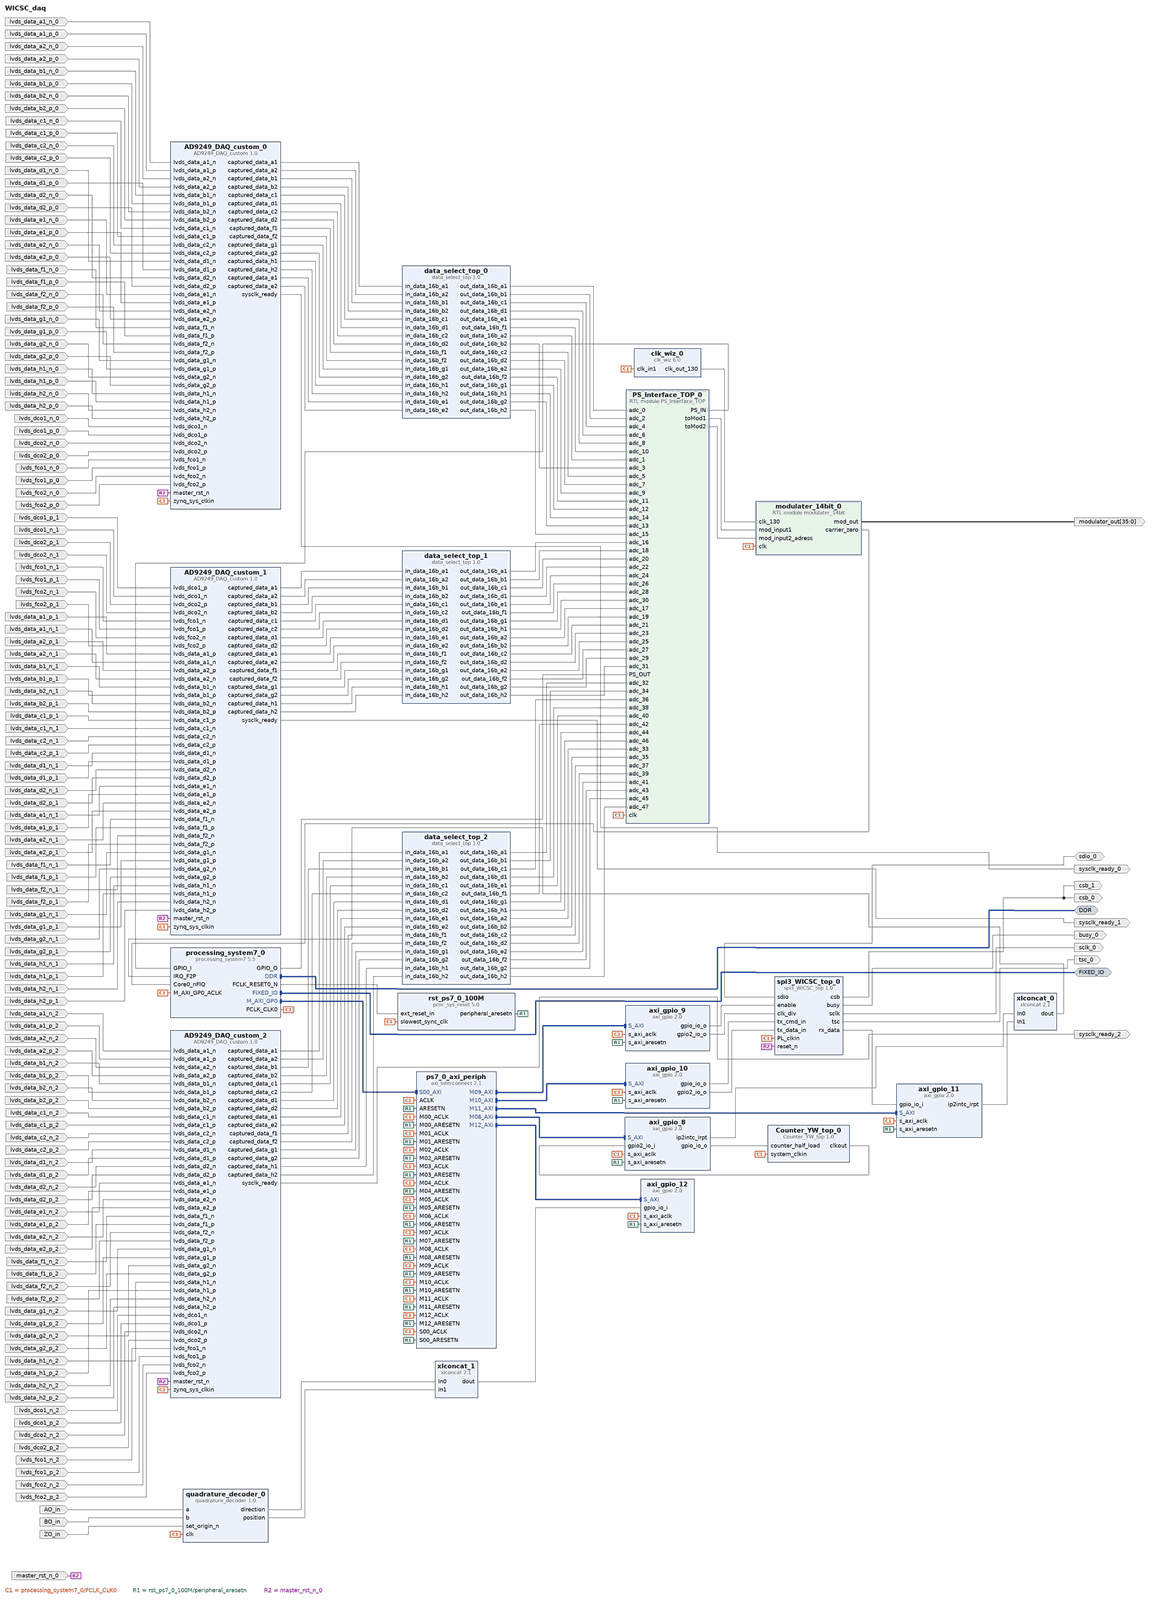
[diagram p0: block diagram of the top level, whole]
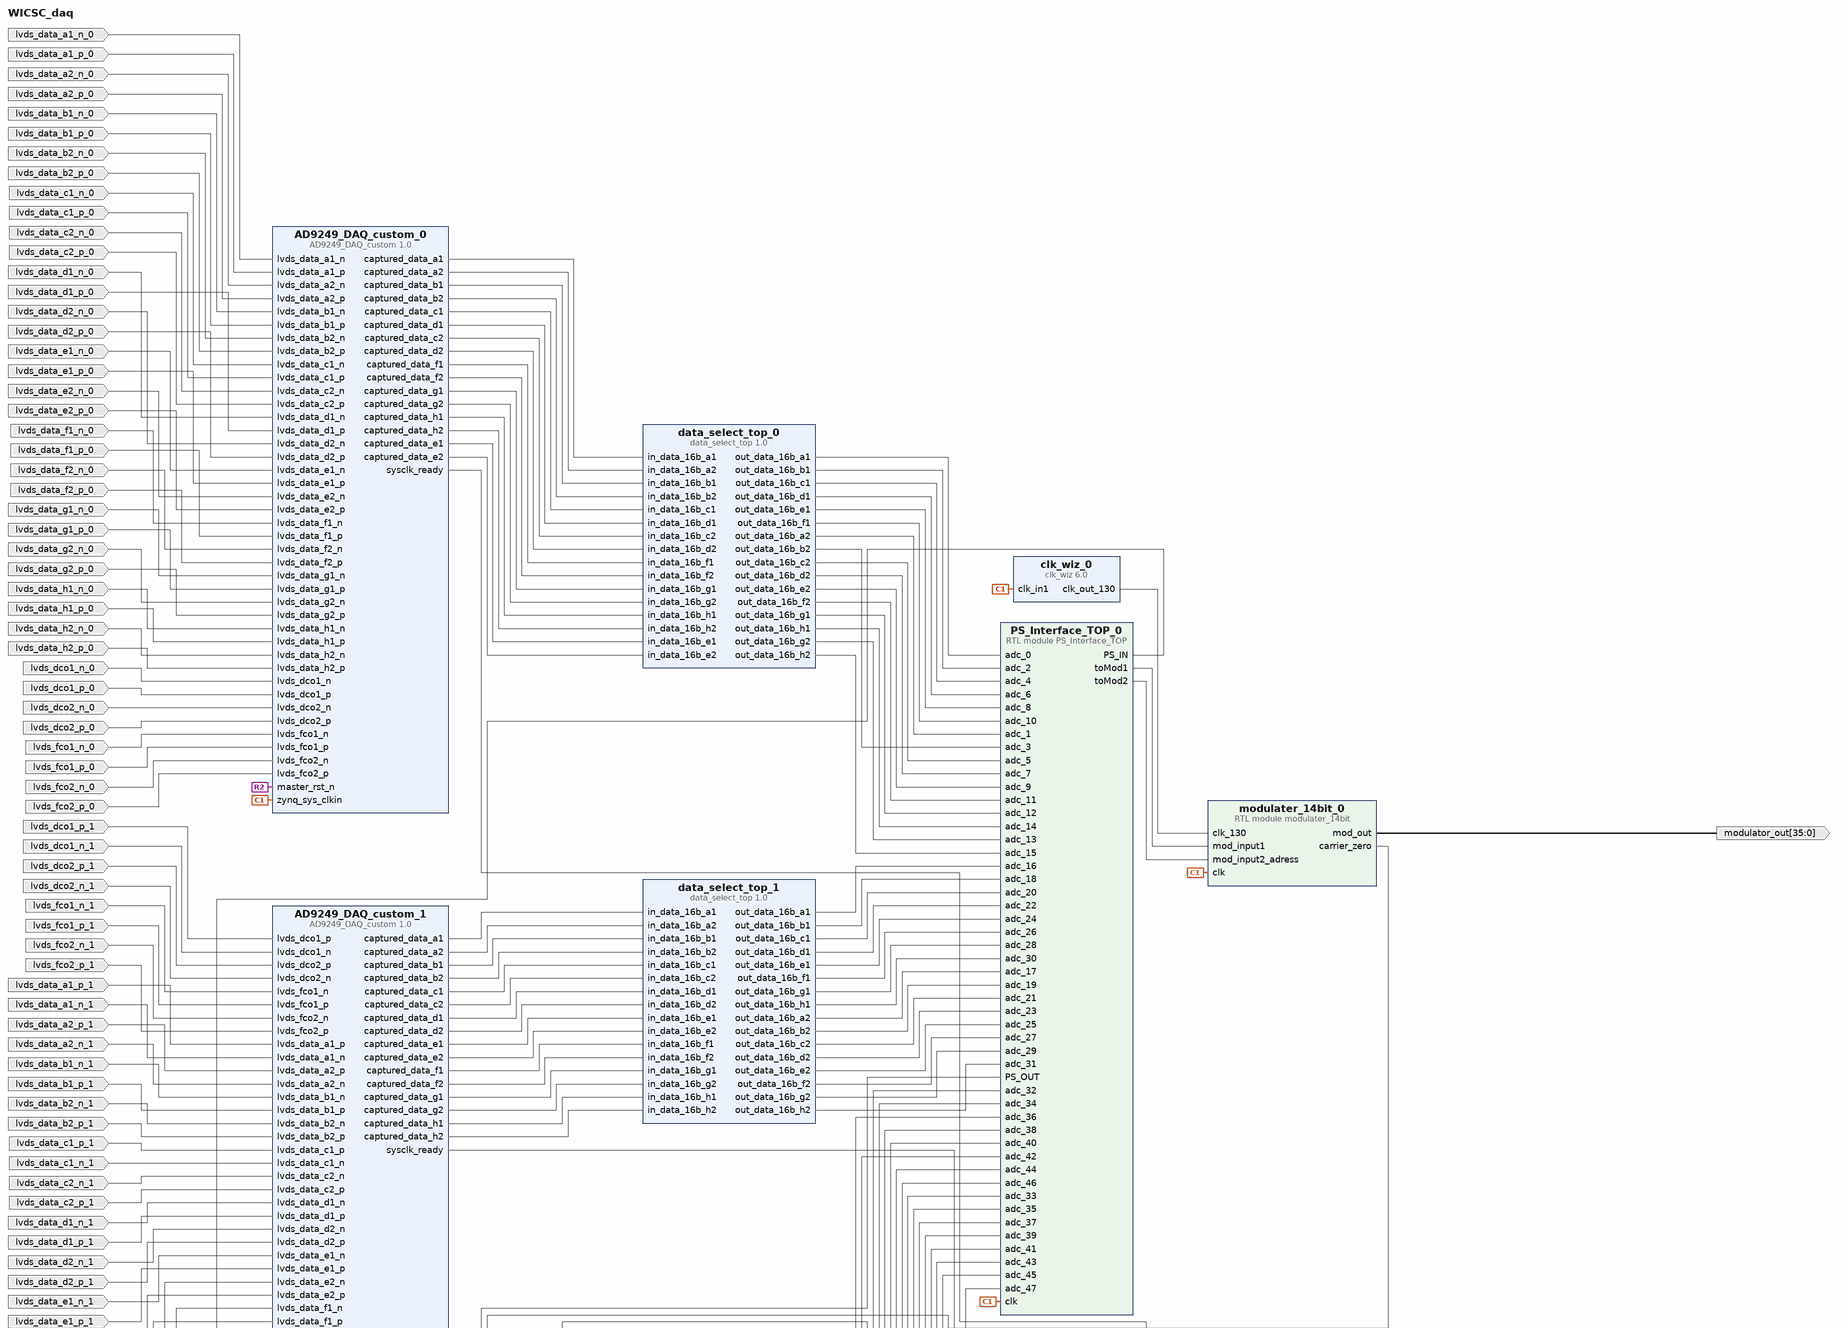
[diagram p1: block diagram of the top level, upper part]
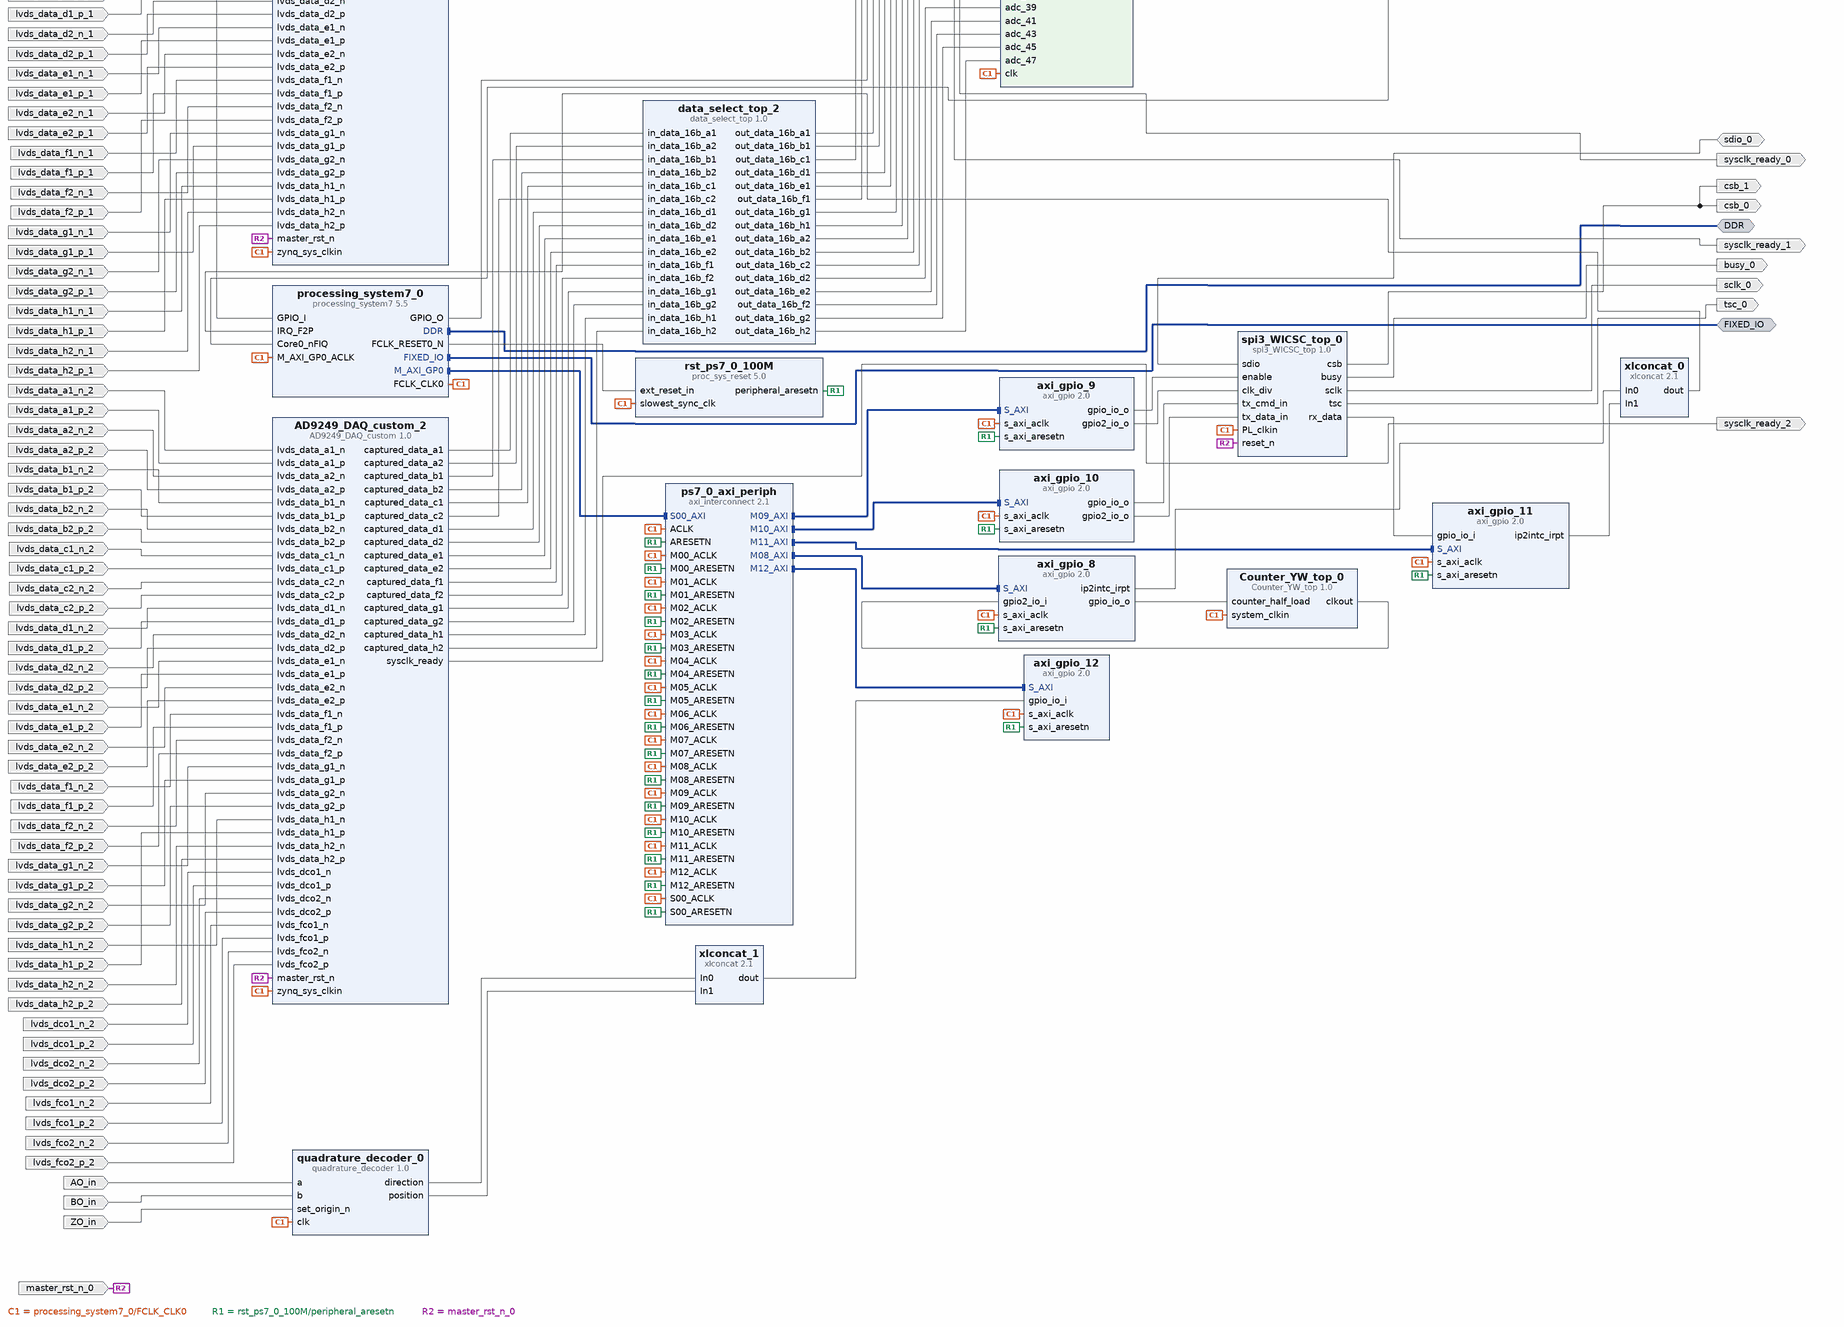
[diagram p2: block diagram of the top level, lower part]
# Vivado block design WICSC_daq, xc7z020clg484-1, Vivado 2020.1
create_bd_design WICSC_daq

create_bd_intf_port -mode Master -vlnv xilinx.com:interface:ddrx_rtl:1.0 DDR
create_bd_intf_port -mode Master -vlnv xilinx.com:display_processing_system7:fixedio_rtl:1.0 FIXED_IO
create_bd_port -dir I lvds_data_a1_n_0
create_bd_port -dir I lvds_data_a1_p_0
create_bd_port -dir I lvds_data_a2_n_0
create_bd_port -dir I lvds_data_a2_p_0
create_bd_port -dir I lvds_data_b1_n_0
create_bd_port -dir I lvds_data_b1_p_0
create_bd_port -dir I lvds_data_b2_n_0
create_bd_port -dir I lvds_data_b2_p_0
create_bd_port -dir I lvds_data_c1_n_0
create_bd_port -dir I lvds_data_c1_p_0
create_bd_port -dir I lvds_data_c2_n_0
create_bd_port -dir I lvds_data_c2_p_0
create_bd_port -dir I lvds_data_d1_n_0
create_bd_port -dir I lvds_data_d1_p_0
create_bd_port -dir I lvds_data_d2_n_0
create_bd_port -dir I lvds_data_d2_p_0
create_bd_port -dir I lvds_data_e1_n_0
create_bd_port -dir I lvds_data_e1_p_0
create_bd_port -dir I lvds_data_e2_n_0
create_bd_port -dir I lvds_data_e2_p_0
create_bd_port -dir I lvds_data_f1_n_0
create_bd_port -dir I lvds_data_f1_p_0
create_bd_port -dir I lvds_data_f2_n_0
create_bd_port -dir I lvds_data_f2_p_0
create_bd_port -dir I lvds_data_g1_n_0
create_bd_port -dir I lvds_data_g1_p_0
create_bd_port -dir I lvds_data_g2_n_0
create_bd_port -dir I lvds_data_g2_p_0
create_bd_port -dir I lvds_data_h1_n_0
create_bd_port -dir I lvds_data_h1_p_0
create_bd_port -dir I lvds_data_h2_n_0
create_bd_port -dir I lvds_data_h2_p_0
create_bd_port -dir I lvds_dco1_n_0
create_bd_port -dir I lvds_dco1_p_0
create_bd_port -dir I lvds_dco2_n_0
create_bd_port -dir I lvds_dco2_p_0
create_bd_port -dir I lvds_fco1_n_0
create_bd_port -dir I lvds_fco1_p_0
create_bd_port -dir I lvds_fco2_n_0
create_bd_port -dir I lvds_fco2_p_0
create_bd_port -dir I -type rst master_rst_n_0
create_bd_port -dir O sysclk_ready_0
create_bd_port -dir O busy_0
create_bd_port -dir O csb_0
create_bd_port -dir O sclk_0
create_bd_port -dir IO sdio_0
create_bd_port -dir O tsc_0
create_bd_port -dir O csb_1
create_bd_port -dir I AO_in
create_bd_port -dir I BO_in
create_bd_port -dir I ZO_in
create_bd_port -dir I lvds_data_a1_n_1
create_bd_port -dir I lvds_data_a1_p_1
create_bd_port -dir I lvds_data_a2_n_1
create_bd_port -dir I lvds_data_a2_p_1
create_bd_port -dir I lvds_data_b1_n_1
create_bd_port -dir I lvds_data_b1_p_1
create_bd_port -dir I lvds_data_b2_n_1
create_bd_port -dir I lvds_data_b2_p_1
create_bd_port -dir I lvds_data_c1_n_1
create_bd_port -dir I lvds_data_c1_p_1
create_bd_port -dir I lvds_data_c2_n_1
create_bd_port -dir I lvds_data_c2_p_1
create_bd_port -dir I lvds_data_d1_n_1
create_bd_port -dir I lvds_data_d1_p_1
create_bd_port -dir I lvds_data_d2_n_1
create_bd_port -dir I lvds_data_d2_p_1
create_bd_port -dir I lvds_data_e1_n_1
create_bd_port -dir I lvds_data_e1_p_1
create_bd_port -dir I lvds_data_e2_n_1
create_bd_port -dir I lvds_data_e2_p_1
create_bd_port -dir I lvds_data_f1_n_1
create_bd_port -dir I lvds_data_f1_p_1
create_bd_port -dir I lvds_data_f2_n_1
create_bd_port -dir I lvds_data_f2_p_1
create_bd_port -dir I lvds_data_g1_n_1
create_bd_port -dir I lvds_data_g1_p_1
create_bd_port -dir I lvds_data_g2_n_1
create_bd_port -dir I lvds_data_g2_p_1
create_bd_port -dir I lvds_data_h1_n_1
create_bd_port -dir I lvds_data_h1_p_1
create_bd_port -dir I lvds_data_h2_n_1
create_bd_port -dir I lvds_data_h2_p_1
create_bd_port -dir I lvds_dco1_n_1
create_bd_port -dir I lvds_dco1_p_1
create_bd_port -dir I lvds_dco2_n_1
create_bd_port -dir I lvds_dco2_p_1
create_bd_port -dir I lvds_fco1_n_1
create_bd_port -dir I lvds_fco1_p_1
create_bd_port -dir I lvds_fco2_n_1
create_bd_port -dir I lvds_fco2_p_1
create_bd_port -dir I lvds_data_a1_n_2
create_bd_port -dir I lvds_data_a1_p_2
create_bd_port -dir I lvds_data_a2_n_2
create_bd_port -dir I lvds_data_a2_p_2
create_bd_port -dir I lvds_data_b1_n_2
create_bd_port -dir I lvds_data_b1_p_2
create_bd_port -dir I lvds_data_b2_n_2
create_bd_port -dir I lvds_data_b2_p_2
create_bd_port -dir I lvds_data_c1_n_2
create_bd_port -dir I lvds_data_c1_p_2
create_bd_port -dir I lvds_data_c2_n_2
create_bd_port -dir I lvds_data_c2_p_2
create_bd_port -dir I lvds_data_d1_n_2
create_bd_port -dir I lvds_data_d1_p_2
create_bd_port -dir I lvds_data_d2_n_2
create_bd_port -dir I lvds_data_d2_p_2
create_bd_port -dir I lvds_data_e1_n_2
create_bd_port -dir I lvds_data_e1_p_2
create_bd_port -dir I lvds_data_e2_n_2
create_bd_port -dir I lvds_data_e2_p_2
create_bd_port -dir I lvds_data_f1_n_2
create_bd_port -dir I lvds_data_f1_p_2
create_bd_port -dir I lvds_data_f2_n_2
create_bd_port -dir I lvds_data_f2_p_2
create_bd_port -dir I lvds_data_g1_n_2
create_bd_port -dir I lvds_data_g1_p_2
create_bd_port -dir I lvds_data_g2_n_2
create_bd_port -dir I lvds_data_g2_p_2
create_bd_port -dir I lvds_data_h1_n_2
create_bd_port -dir I lvds_data_h1_p_2
create_bd_port -dir I lvds_data_h2_n_2
create_bd_port -dir I lvds_data_h2_p_2
create_bd_port -dir I lvds_dco1_n_2
create_bd_port -dir I lvds_dco1_p_2
create_bd_port -dir I lvds_dco2_n_2
create_bd_port -dir I lvds_dco2_p_2
create_bd_port -dir I lvds_fco1_n_2
create_bd_port -dir I lvds_fco1_p_2
create_bd_port -dir I lvds_fco2_n_2
create_bd_port -dir I lvds_fco2_p_2
create_bd_port -dir O -from 35 -to 0 -type data modulator_out
create_bd_port -dir O sysclk_ready_1
create_bd_port -dir O sysclk_ready_2

create_bd_cell -type ip -vlnv xilinx.com:ip:processing_system7:5.5 processing_system7_0
set_property -dict [list \
  CONFIG.PCW_APU_PERIPHERAL_FREQMHZ 666.666666 \
  CONFIG.PCW_CAN0_CAN0_IO {MIO 46 .. 47} \
  CONFIG.PCW_CAN0_PERIPHERAL_ENABLE 1 \
  CONFIG.PCW_CAN_PERIPHERAL_FREQMHZ 23.8095 \
  CONFIG.PCW_CORE0_FIQ_INTR 1 \
  CONFIG.PCW_ENET0_ENET0_IO {MIO 16 .. 27} \
  CONFIG.PCW_ENET0_GRP_MDIO_ENABLE 1 \
  CONFIG.PCW_ENET0_GRP_MDIO_IO {MIO 52 .. 53} \
  CONFIG.PCW_ENET0_PERIPHERAL_ENABLE 1 \
  CONFIG.PCW_ENET0_PERIPHERAL_FREQMHZ {100 Mbps} \
  CONFIG.PCW_ENET0_RESET_ENABLE 1 \
  CONFIG.PCW_ENET0_RESET_IO {MIO 11} \
  CONFIG.PCW_ENET_RESET_ENABLE 1 \
  CONFIG.PCW_ENET_RESET_SELECT {Share reset pin} \
  CONFIG.PCW_FPGA0_PERIPHERAL_FREQMHZ 100 \
  CONFIG.PCW_GPIO_EMIO_GPIO_ENABLE 1 \
  CONFIG.PCW_GPIO_EMIO_GPIO_IO 64 \
  CONFIG.PCW_GPIO_MIO_GPIO_ENABLE 1 \
  CONFIG.PCW_GPIO_MIO_GPIO_IO MIO \
  CONFIG.PCW_I2C0_GRP_INT_ENABLE 0 \
  CONFIG.PCW_I2C0_I2C0_IO {MIO 50 .. 51} \
  CONFIG.PCW_I2C0_PERIPHERAL_ENABLE 1 \
  CONFIG.PCW_I2C0_RESET_ENABLE 1 \
  CONFIG.PCW_I2C0_RESET_IO {MIO 13} \
  CONFIG.PCW_I2C_PERIPHERAL_FREQMHZ 111.111115 \
  CONFIG.PCW_I2C_RESET_ENABLE 1 \
  CONFIG.PCW_I2C_RESET_SELECT {Share reset pin} \
  CONFIG.PCW_IRQ_F2P_INTR 1 \
  CONFIG.PCW_PRESET_BANK0_VOLTAGE {LVCMOS 1.8V} \
  CONFIG.PCW_PRESET_BANK1_VOLTAGE {LVCMOS 1.8V} \
  CONFIG.PCW_QSPI_GRP_FBCLK_ENABLE 1 \
  CONFIG.PCW_QSPI_GRP_FBCLK_IO {MIO 8} \
  CONFIG.PCW_QSPI_GRP_SINGLE_SS_ENABLE 1 \
  CONFIG.PCW_QSPI_GRP_SINGLE_SS_IO {MIO 1 .. 6} \
  CONFIG.PCW_QSPI_PERIPHERAL_ENABLE 1 \
  CONFIG.PCW_QSPI_QSPI_IO {MIO 1 .. 6} \
  CONFIG.PCW_SD0_GRP_CD_ENABLE 1 \
  CONFIG.PCW_SD0_GRP_CD_IO {MIO 0} \
  CONFIG.PCW_SD0_GRP_WP_ENABLE 1 \
  CONFIG.PCW_SD0_GRP_WP_IO {MIO 15} \
  CONFIG.PCW_SD0_PERIPHERAL_ENABLE 1 \
  CONFIG.PCW_SD0_SD0_IO {MIO 40 .. 45} \
  CONFIG.PCW_SDIO_PERIPHERAL_FREQMHZ 50 \
  CONFIG.PCW_SINGLE_QSPI_DATA_MODE x4 \
  CONFIG.PCW_TTC0_PERIPHERAL_ENABLE 1 \
  CONFIG.PCW_TTC0_TTC0_IO EMIO \
  CONFIG.PCW_UART1_PERIPHERAL_ENABLE 1 \
  CONFIG.PCW_UART1_UART1_IO {MIO 48 .. 49} \
  CONFIG.PCW_UART_PERIPHERAL_FREQMHZ 50 \
  CONFIG.PCW_UIPARAM_DDR_FREQ_MHZ 533.333333 \
  CONFIG.PCW_UIPARAM_DDR_PARTNO {MT41J256M8 HX-15E} \
  CONFIG.PCW_USB0_PERIPHERAL_ENABLE 1 \
  CONFIG.PCW_USB0_RESET_ENABLE 1 \
  CONFIG.PCW_USB0_RESET_IO {MIO 7} \
  CONFIG.PCW_USB0_USB0_IO {MIO 28 .. 39} \
  CONFIG.PCW_USB_RESET_ENABLE 1 \
  CONFIG.PCW_USB_RESET_SELECT {Share reset pin} \
  CONFIG.PCW_USE_FABRIC_INTERRUPT 1 \
  CONFIG.preset ZC702 \
] [get_bd_cells processing_system7_0]
# 224 more settings of processing_system7_0 are not shown: defaults, MIO pin electricals, DDR timing, and values the tool derives
create_bd_cell -type ip -vlnv xilinx.com:ip:axi_interconnect:2.1 ps7_0_axi_periph
set_property -dict {CONFIG.NUM_MI 13} [get_bd_cells ps7_0_axi_periph]
create_bd_cell -type ip -vlnv xilinx.com:ip:proc_sys_reset:5.0 rst_ps7_0_100M
create_bd_cell -type ip -vlnv kth.se:user:Counter_YW_top:1.0 Counter_YW_top_0
create_bd_cell -type ip -vlnv xilinx.com:ip:axi_gpio:2.0 axi_gpio_8
set_property -dict [list \
  CONFIG.C_ALL_INPUTS_2 1 \
  CONFIG.C_ALL_OUTPUTS 1 \
  CONFIG.C_GPIO2_WIDTH 1 \
  CONFIG.C_INTERRUPT_PRESENT 1 \
  CONFIG.C_IS_DUAL 1 \
] [get_bd_cells axi_gpio_8]
create_bd_cell -type ip -vlnv kth.se:user:AD9249_DAQ_custom:1.0 AD9249_DAQ_custom_0
set_property -dict {CONFIG.ADC_MAX_DATA_SIZE 16} [get_bd_cells AD9249_DAQ_custom_0]
create_bd_cell -type ip -vlnv kth.se:user:spi3_WICSC_top:1.0 spi3_WICSC_top_0
create_bd_cell -type ip -vlnv xilinx.com:ip:axi_gpio:2.0 axi_gpio_9
set_property -dict [list \
  CONFIG.C_ALL_OUTPUTS 1 \
  CONFIG.C_ALL_OUTPUTS_2 1 \
  CONFIG.C_GPIO_WIDTH 1 \
  CONFIG.C_IS_DUAL 1 \
] [get_bd_cells axi_gpio_9]
create_bd_cell -type ip -vlnv xilinx.com:ip:axi_gpio:2.0 axi_gpio_10
set_property -dict [list \
  CONFIG.C_ALL_OUTPUTS 1 \
  CONFIG.C_ALL_OUTPUTS_2 1 \
  CONFIG.C_GPIO2_WIDTH 8 \
  CONFIG.C_GPIO_WIDTH 16 \
  CONFIG.C_IS_DUAL 1 \
] [get_bd_cells axi_gpio_10]
create_bd_cell -type ip -vlnv xilinx.com:ip:axi_gpio:2.0 axi_gpio_11
set_property -dict {CONFIG.C_ALL_INPUTS 1 CONFIG.C_GPIO_WIDTH 8 CONFIG.C_INTERRUPT_PRESENT 1} [get_bd_cells axi_gpio_11]
create_bd_cell -type ip -vlnv xilinx.com:ip:xlconcat:2.1 xlconcat_0
create_bd_cell -type ip -vlnv kth.se:user:data_select_top:1.0 data_select_top_0
create_bd_cell -type ip -vlnv kth.se:user:quadrature_decoder:1.0 quadrature_decoder_0
set_property -dict [list \
  CONFIG.debounce_time 48 \
  CONFIG.positions 16384 \
  CONFIG.set_origin_debounce_time 48 \
] [get_bd_cells quadrature_decoder_0]
create_bd_cell -type ip -vlnv xilinx.com:ip:axi_gpio:2.0 axi_gpio_12
set_property -dict {CONFIG.C_ALL_INPUTS 1 CONFIG.C_GPIO_WIDTH 17} [get_bd_cells axi_gpio_12]
create_bd_cell -type ip -vlnv xilinx.com:ip:xlconcat:2.1 xlconcat_1
create_bd_cell -type ip -vlnv kth.se:user:AD9249_DAQ_custom:1.0 AD9249_DAQ_custom_1
create_bd_cell -type ip -vlnv kth.se:user:data_select_top:1.0 data_select_top_1
create_bd_cell -type ip -vlnv kth.se:user:AD9249_DAQ_custom:1.0 AD9249_DAQ_custom_2
create_bd_cell -type ip -vlnv kth.se:user:data_select_top:1.0 data_select_top_2
create_bd_cell -type ip -vlnv xilinx.com:ip:clk_wiz:6.0 clk_wiz_0
set_property -dict [list \
  CONFIG.CLKOUT1_JITTER 231.118 \
  CONFIG.CLKOUT1_PHASE_ERROR 297.890 \
  CONFIG.CLKOUT1_REQUESTED_OUT_FREQ 130.000 \
  CONFIG.CLK_OUT1_PORT clk_out_130 \
  CONFIG.MMCM_CLKFBOUT_MULT_F 50.375 \
  CONFIG.MMCM_CLKOUT0_DIVIDE_F 7.750 \
  CONFIG.MMCM_DIVCLK_DIVIDE 5 \
] [get_bd_cells clk_wiz_0]
create_bd_cell -type module -reference modulater_14bit modulater_14bit_0
create_bd_cell -type module -reference PS_Interface_TOP PS_Interface_TOP_0

# ---- connections ----

connect_bd_intf_net [get_bd_intf_pins ps7_0_axi_periph/M08_AXI] [get_bd_intf_pins axi_gpio_8/S_AXI]
connect_bd_intf_net [get_bd_intf_pins ps7_0_axi_periph/M12_AXI] [get_bd_intf_pins axi_gpio_12/S_AXI]
connect_bd_intf_net [get_bd_intf_pins ps7_0_axi_periph/M11_AXI] [get_bd_intf_pins axi_gpio_11/S_AXI]
connect_bd_intf_net [get_bd_intf_ports DDR] [get_bd_intf_pins processing_system7_0/DDR]
connect_bd_intf_net [get_bd_intf_ports FIXED_IO] [get_bd_intf_pins processing_system7_0/FIXED_IO]
connect_bd_intf_net [get_bd_intf_pins ps7_0_axi_periph/M10_AXI] [get_bd_intf_pins axi_gpio_10/S_AXI]
connect_bd_intf_net [get_bd_intf_pins processing_system7_0/M_AXI_GP0] [get_bd_intf_pins ps7_0_axi_periph/S00_AXI]
connect_bd_intf_net [get_bd_intf_pins ps7_0_axi_periph/M09_AXI] [get_bd_intf_pins axi_gpio_9/S_AXI]
connect_bd_net [get_bd_pins processing_system7_0/FCLK_CLK0] \
  [get_bd_pins processing_system7_0/M_AXI_GP0_ACLK] [get_bd_pins ps7_0_axi_periph/S00_ACLK] \
  [get_bd_pins rst_ps7_0_100M/slowest_sync_clk] [get_bd_pins ps7_0_axi_periph/M00_ACLK] [get_bd_pins ps7_0_axi_periph/ACLK] \
  [get_bd_pins ps7_0_axi_periph/M01_ACLK] [get_bd_pins ps7_0_axi_periph/M02_ACLK] [get_bd_pins ps7_0_axi_periph/M03_ACLK] \
  [get_bd_pins ps7_0_axi_periph/M04_ACLK] [get_bd_pins ps7_0_axi_periph/M05_ACLK] [get_bd_pins ps7_0_axi_periph/M06_ACLK] \
  [get_bd_pins ps7_0_axi_periph/M07_ACLK] [get_bd_pins Counter_YW_top_0/system_clkin] [get_bd_pins axi_gpio_8/s_axi_aclk] \
  [get_bd_pins ps7_0_axi_periph/M08_ACLK] [get_bd_pins AD9249_DAQ_custom_0/zynq_sys_clkin] \
  [get_bd_pins ps7_0_axi_periph/M09_ACLK] [get_bd_pins ps7_0_axi_periph/M10_ACLK] [get_bd_pins ps7_0_axi_periph/M11_ACLK] \
  [get_bd_pins spi3_WICSC_top_0/PL_clkin] [get_bd_pins axi_gpio_9/s_axi_aclk] [get_bd_pins axi_gpio_10/s_axi_aclk] \
  [get_bd_pins axi_gpio_11/s_axi_aclk] [get_bd_pins quadrature_decoder_0/clk] [get_bd_pins axi_gpio_12/s_axi_aclk] \
  [get_bd_pins ps7_0_axi_periph/M12_ACLK] [get_bd_pins AD9249_DAQ_custom_1/zynq_sys_clkin] [get_bd_pins clk_wiz_0/clk_in1] \
  [get_bd_pins AD9249_DAQ_custom_2/zynq_sys_clkin] [get_bd_pins modulater_14bit_0/clk] [get_bd_pins PS_Interface_TOP_0/clk]
connect_bd_net [get_bd_pins processing_system7_0/FCLK_RESET0_N] [get_bd_pins rst_ps7_0_100M/ext_reset_in]
connect_bd_net [get_bd_pins rst_ps7_0_100M/peripheral_aresetn] \
  [get_bd_pins ps7_0_axi_periph/S00_ARESETN] [get_bd_pins ps7_0_axi_periph/M00_ARESETN] \
  [get_bd_pins ps7_0_axi_periph/ARESETN] [get_bd_pins ps7_0_axi_periph/M01_ARESETN] \
  [get_bd_pins ps7_0_axi_periph/M02_ARESETN] [get_bd_pins ps7_0_axi_periph/M03_ARESETN] \
  [get_bd_pins ps7_0_axi_periph/M04_ARESETN] [get_bd_pins ps7_0_axi_periph/M05_ARESETN] \
  [get_bd_pins ps7_0_axi_periph/M06_ARESETN] [get_bd_pins ps7_0_axi_periph/M07_ARESETN] \
  [get_bd_pins axi_gpio_8/s_axi_aresetn] [get_bd_pins ps7_0_axi_periph/M08_ARESETN] \
  [get_bd_pins ps7_0_axi_periph/M09_ARESETN] [get_bd_pins ps7_0_axi_periph/M10_ARESETN] \
  [get_bd_pins ps7_0_axi_periph/M11_ARESETN] [get_bd_pins axi_gpio_9/s_axi_aresetn] [get_bd_pins axi_gpio_10/s_axi_aresetn] \
  [get_bd_pins axi_gpio_11/s_axi_aresetn] [get_bd_pins axi_gpio_12/s_axi_aresetn] [get_bd_pins ps7_0_axi_periph/M12_ARESETN]
connect_bd_net -net lvds_data_a1_n_0_1 [get_bd_ports lvds_data_a1_n_0] [get_bd_pins AD9249_DAQ_custom_0/lvds_data_a1_n]
connect_bd_net -net lvds_data_a1_p_0_1 [get_bd_ports lvds_data_a1_p_0] [get_bd_pins AD9249_DAQ_custom_0/lvds_data_a1_p]
connect_bd_net -net lvds_data_a2_n_0_1 [get_bd_ports lvds_data_a2_n_0] [get_bd_pins AD9249_DAQ_custom_0/lvds_data_a2_n]
connect_bd_net -net lvds_data_a2_p_0_1 [get_bd_ports lvds_data_a2_p_0] [get_bd_pins AD9249_DAQ_custom_0/lvds_data_a2_p]
connect_bd_net -net lvds_data_b1_n_0_1 [get_bd_ports lvds_data_b1_n_0] [get_bd_pins AD9249_DAQ_custom_0/lvds_data_b1_n]
connect_bd_net -net lvds_data_b1_p_0_1 [get_bd_ports lvds_data_b1_p_0] [get_bd_pins AD9249_DAQ_custom_0/lvds_data_b1_p]
connect_bd_net -net lvds_data_b2_n_0_1 [get_bd_ports lvds_data_b2_n_0] [get_bd_pins AD9249_DAQ_custom_0/lvds_data_b2_n]
connect_bd_net -net lvds_data_b2_p_0_1 [get_bd_ports lvds_data_b2_p_0] [get_bd_pins AD9249_DAQ_custom_0/lvds_data_b2_p]
connect_bd_net -net lvds_data_c1_n_0_1 [get_bd_ports lvds_data_c1_n_0] [get_bd_pins AD9249_DAQ_custom_0/lvds_data_c1_n]
connect_bd_net -net lvds_data_c1_p_0_1 [get_bd_ports lvds_data_c1_p_0] [get_bd_pins AD9249_DAQ_custom_0/lvds_data_c1_p]
connect_bd_net -net lvds_data_c2_n_0_1 [get_bd_ports lvds_data_c2_n_0] [get_bd_pins AD9249_DAQ_custom_0/lvds_data_c2_n]
connect_bd_net -net lvds_data_c2_p_0_1 [get_bd_ports lvds_data_c2_p_0] [get_bd_pins AD9249_DAQ_custom_0/lvds_data_c2_p]
connect_bd_net -net lvds_data_d1_n_0_1 [get_bd_ports lvds_data_d1_n_0] [get_bd_pins AD9249_DAQ_custom_0/lvds_data_d1_n]
connect_bd_net -net lvds_data_d1_p_0_1 [get_bd_ports lvds_data_d1_p_0] [get_bd_pins AD9249_DAQ_custom_0/lvds_data_d1_p]
connect_bd_net -net lvds_data_d2_n_0_1 [get_bd_ports lvds_data_d2_n_0] [get_bd_pins AD9249_DAQ_custom_0/lvds_data_d2_n]
connect_bd_net -net lvds_data_d2_p_0_1 [get_bd_ports lvds_data_d2_p_0] [get_bd_pins AD9249_DAQ_custom_0/lvds_data_d2_p]
connect_bd_net -net lvds_data_e1_n_0_1 [get_bd_ports lvds_data_e1_n_0] [get_bd_pins AD9249_DAQ_custom_0/lvds_data_e1_n]
connect_bd_net -net lvds_data_e1_p_0_1 [get_bd_ports lvds_data_e1_p_0] [get_bd_pins AD9249_DAQ_custom_0/lvds_data_e1_p]
connect_bd_net -net lvds_data_e2_n_0_1 [get_bd_ports lvds_data_e2_n_0] [get_bd_pins AD9249_DAQ_custom_0/lvds_data_e2_n]
connect_bd_net -net lvds_data_e2_p_0_1 [get_bd_ports lvds_data_e2_p_0] [get_bd_pins AD9249_DAQ_custom_0/lvds_data_e2_p]
connect_bd_net -net lvds_data_f1_n_0_1 [get_bd_ports lvds_data_f1_n_0] [get_bd_pins AD9249_DAQ_custom_0/lvds_data_f1_n]
connect_bd_net -net lvds_data_f1_p_0_1 [get_bd_ports lvds_data_f1_p_0] [get_bd_pins AD9249_DAQ_custom_0/lvds_data_f1_p]
connect_bd_net -net lvds_data_f2_n_0_1 [get_bd_ports lvds_data_f2_n_0] [get_bd_pins AD9249_DAQ_custom_0/lvds_data_f2_n]
connect_bd_net -net lvds_data_f2_p_0_1 [get_bd_ports lvds_data_f2_p_0] [get_bd_pins AD9249_DAQ_custom_0/lvds_data_f2_p]
connect_bd_net -net lvds_data_g1_n_0_1 [get_bd_ports lvds_data_g1_n_0] [get_bd_pins AD9249_DAQ_custom_0/lvds_data_g1_n]
connect_bd_net -net lvds_data_g1_p_0_1 [get_bd_ports lvds_data_g1_p_0] [get_bd_pins AD9249_DAQ_custom_0/lvds_data_g1_p]
connect_bd_net -net lvds_data_g2_n_0_1 [get_bd_ports lvds_data_g2_n_0] [get_bd_pins AD9249_DAQ_custom_0/lvds_data_g2_n]
connect_bd_net -net lvds_data_g2_p_0_1 [get_bd_ports lvds_data_g2_p_0] [get_bd_pins AD9249_DAQ_custom_0/lvds_data_g2_p]
connect_bd_net -net lvds_data_h1_n_0_1 [get_bd_ports lvds_data_h1_n_0] [get_bd_pins AD9249_DAQ_custom_0/lvds_data_h1_n]
connect_bd_net -net lvds_data_h1_p_0_1 [get_bd_ports lvds_data_h1_p_0] [get_bd_pins AD9249_DAQ_custom_0/lvds_data_h1_p]
connect_bd_net -net lvds_data_h2_n_0_1 [get_bd_ports lvds_data_h2_n_0] [get_bd_pins AD9249_DAQ_custom_0/lvds_data_h2_n]
connect_bd_net -net lvds_data_h2_p_0_1 [get_bd_ports lvds_data_h2_p_0] [get_bd_pins AD9249_DAQ_custom_0/lvds_data_h2_p]
connect_bd_net -net lvds_dco1_n_0_1 [get_bd_ports lvds_dco1_n_0] [get_bd_pins AD9249_DAQ_custom_0/lvds_dco1_n]
connect_bd_net -net lvds_dco1_p_0_1 [get_bd_ports lvds_dco1_p_0] [get_bd_pins AD9249_DAQ_custom_0/lvds_dco1_p]
connect_bd_net -net lvds_dco2_n_0_1 [get_bd_ports lvds_dco2_n_0] [get_bd_pins AD9249_DAQ_custom_0/lvds_dco2_n]
connect_bd_net -net lvds_dco2_p_0_1 [get_bd_ports lvds_dco2_p_0] [get_bd_pins AD9249_DAQ_custom_0/lvds_dco2_p]
connect_bd_net -net lvds_fco1_n_0_1 [get_bd_ports lvds_fco1_n_0] [get_bd_pins AD9249_DAQ_custom_0/lvds_fco1_n]
connect_bd_net -net lvds_fco1_p_0_1 [get_bd_ports lvds_fco1_p_0] [get_bd_pins AD9249_DAQ_custom_0/lvds_fco1_p]
connect_bd_net -net lvds_fco2_n_0_1 [get_bd_ports lvds_fco2_n_0] [get_bd_pins AD9249_DAQ_custom_0/lvds_fco2_n]
connect_bd_net -net lvds_fco2_p_0_1 [get_bd_ports lvds_fco2_p_0] [get_bd_pins AD9249_DAQ_custom_0/lvds_fco2_p]
connect_bd_net -net master_rst_n_0_1 [get_bd_ports master_rst_n_0] \
  [get_bd_pins AD9249_DAQ_custom_0/master_rst_n] [get_bd_pins spi3_WICSC_top_0/reset_n] \
  [get_bd_pins AD9249_DAQ_custom_2/master_rst_n] [get_bd_pins AD9249_DAQ_custom_1/master_rst_n]
connect_bd_net [get_bd_pins AD9249_DAQ_custom_0/sysclk_ready] [get_bd_ports sysclk_ready_0]
connect_bd_net [get_bd_pins axi_gpio_8/gpio_io_o] [get_bd_pins Counter_YW_top_0/counter_half_load]
connect_bd_net [get_bd_pins Counter_YW_top_0/clkout] [get_bd_pins axi_gpio_8/gpio2_io_i]
connect_bd_net [get_bd_pins axi_gpio_9/gpio_io_o] [get_bd_pins spi3_WICSC_top_0/enable]
connect_bd_net [get_bd_pins axi_gpio_9/gpio2_io_o] [get_bd_pins spi3_WICSC_top_0/clk_div]
connect_bd_net [get_bd_pins axi_gpio_10/gpio_io_o] [get_bd_pins spi3_WICSC_top_0/tx_cmd_in]
connect_bd_net [get_bd_pins axi_gpio_10/gpio2_io_o] [get_bd_pins spi3_WICSC_top_0/tx_data_in]
connect_bd_net [get_bd_pins spi3_WICSC_top_0/rx_data] [get_bd_pins axi_gpio_11/gpio_io_i]
connect_bd_net [get_bd_pins axi_gpio_11/ip2intc_irpt] [get_bd_pins xlconcat_0/In1]
connect_bd_net [get_bd_pins xlconcat_0/dout] [get_bd_pins processing_system7_0/IRQ_F2P]
connect_bd_net [get_bd_pins axi_gpio_8/ip2intc_irpt] [get_bd_pins xlconcat_0/In0]
connect_bd_net [get_bd_pins spi3_WICSC_top_0/busy] [get_bd_ports busy_0]
connect_bd_net [get_bd_pins spi3_WICSC_top_0/csb] [get_bd_ports csb_0] [get_bd_ports csb_1]
connect_bd_net [get_bd_pins spi3_WICSC_top_0/sclk] [get_bd_ports sclk_0]
connect_bd_net [get_bd_ports sdio_0] [get_bd_pins spi3_WICSC_top_0/sdio]
connect_bd_net [get_bd_pins spi3_WICSC_top_0/tsc] [get_bd_ports tsc_0]
connect_bd_net [get_bd_pins AD9249_DAQ_custom_0/captured_data_a1] [get_bd_pins data_select_top_0/in_data_16b_a1]
connect_bd_net [get_bd_pins AD9249_DAQ_custom_0/captured_data_a2] [get_bd_pins data_select_top_0/in_data_16b_a2]
connect_bd_net [get_bd_pins AD9249_DAQ_custom_0/captured_data_b1] [get_bd_pins data_select_top_0/in_data_16b_b1]
connect_bd_net [get_bd_pins AD9249_DAQ_custom_0/captured_data_b2] [get_bd_pins data_select_top_0/in_data_16b_b2]
connect_bd_net [get_bd_pins AD9249_DAQ_custom_0/captured_data_c1] [get_bd_pins data_select_top_0/in_data_16b_c1]
connect_bd_net [get_bd_pins AD9249_DAQ_custom_0/captured_data_d1] [get_bd_pins data_select_top_0/in_data_16b_d1]
connect_bd_net [get_bd_pins AD9249_DAQ_custom_0/captured_data_c2] [get_bd_pins data_select_top_0/in_data_16b_c2]
connect_bd_net [get_bd_pins AD9249_DAQ_custom_0/captured_data_d2] [get_bd_pins data_select_top_0/in_data_16b_d2]
connect_bd_net [get_bd_pins AD9249_DAQ_custom_0/captured_data_f1] [get_bd_pins data_select_top_0/in_data_16b_f1]
connect_bd_net [get_bd_pins AD9249_DAQ_custom_0/captured_data_f2] [get_bd_pins data_select_top_0/in_data_16b_f2]
connect_bd_net [get_bd_pins AD9249_DAQ_custom_0/captured_data_g1] [get_bd_pins data_select_top_0/in_data_16b_g1]
connect_bd_net [get_bd_pins AD9249_DAQ_custom_0/captured_data_g2] [get_bd_pins data_select_top_0/in_data_16b_g2]
connect_bd_net [get_bd_pins AD9249_DAQ_custom_0/captured_data_h1] [get_bd_pins data_select_top_0/in_data_16b_h1]
connect_bd_net [get_bd_pins AD9249_DAQ_custom_0/captured_data_h2] [get_bd_pins data_select_top_0/in_data_16b_h2]
connect_bd_net [get_bd_pins AD9249_DAQ_custom_0/captured_data_e1] [get_bd_pins data_select_top_0/in_data_16b_e1]
connect_bd_net [get_bd_pins AD9249_DAQ_custom_0/captured_data_e2] [get_bd_pins data_select_top_0/in_data_16b_e2]
connect_bd_net -net a_0_1 [get_bd_ports AO_in] [get_bd_pins quadrature_decoder_0/a]
connect_bd_net -net b_0_1 [get_bd_ports BO_in] [get_bd_pins quadrature_decoder_0/b]
connect_bd_net -net set_origin_n_0_1 [get_bd_ports ZO_in] [get_bd_pins quadrature_decoder_0/set_origin_n]
connect_bd_net [get_bd_pins quadrature_decoder_0/direction] [get_bd_pins xlconcat_1/In0]
connect_bd_net [get_bd_pins quadrature_decoder_0/position] [get_bd_pins xlconcat_1/In1]
connect_bd_net [get_bd_pins xlconcat_1/dout] [get_bd_pins axi_gpio_12/gpio_io_i]
connect_bd_net [get_bd_pins AD9249_DAQ_custom_1/captured_data_a1] [get_bd_pins data_select_top_1/in_data_16b_a1]
connect_bd_net [get_bd_pins AD9249_DAQ_custom_1/captured_data_a2] [get_bd_pins data_select_top_1/in_data_16b_a2]
connect_bd_net [get_bd_pins AD9249_DAQ_custom_1/captured_data_b1] [get_bd_pins data_select_top_1/in_data_16b_b1]
connect_bd_net [get_bd_pins AD9249_DAQ_custom_1/captured_data_b2] [get_bd_pins data_select_top_1/in_data_16b_b2]
connect_bd_net [get_bd_pins AD9249_DAQ_custom_1/captured_data_c1] [get_bd_pins data_select_top_1/in_data_16b_c1]
connect_bd_net [get_bd_pins AD9249_DAQ_custom_1/captured_data_c2] [get_bd_pins data_select_top_1/in_data_16b_c2]
connect_bd_net [get_bd_pins AD9249_DAQ_custom_1/captured_data_d1] [get_bd_pins data_select_top_1/in_data_16b_d1]
connect_bd_net [get_bd_pins AD9249_DAQ_custom_1/captured_data_d2] [get_bd_pins data_select_top_1/in_data_16b_d2]
connect_bd_net [get_bd_pins AD9249_DAQ_custom_1/captured_data_e1] [get_bd_pins data_select_top_1/in_data_16b_e1]
connect_bd_net [get_bd_pins AD9249_DAQ_custom_1/captured_data_e2] [get_bd_pins data_select_top_1/in_data_16b_e2]
connect_bd_net [get_bd_pins AD9249_DAQ_custom_1/captured_data_f1] [get_bd_pins data_select_top_1/in_data_16b_f1]
connect_bd_net [get_bd_pins AD9249_DAQ_custom_1/captured_data_f2] [get_bd_pins data_select_top_1/in_data_16b_f2]
connect_bd_net [get_bd_pins AD9249_DAQ_custom_1/captured_data_g1] [get_bd_pins data_select_top_1/in_data_16b_g1]
connect_bd_net [get_bd_pins AD9249_DAQ_custom_1/captured_data_g2] [get_bd_pins data_select_top_1/in_data_16b_g2]
connect_bd_net [get_bd_pins AD9249_DAQ_custom_1/captured_data_h1] [get_bd_pins data_select_top_1/in_data_16b_h1]
connect_bd_net [get_bd_pins AD9249_DAQ_custom_1/captured_data_h2] [get_bd_pins data_select_top_1/in_data_16b_h2]
connect_bd_net -net lvds_dco1_p_1_1 [get_bd_ports lvds_dco1_p_1] [get_bd_pins AD9249_DAQ_custom_1/lvds_dco1_p]
connect_bd_net -net lvds_dco1_n_1_1 [get_bd_ports lvds_dco1_n_1] [get_bd_pins AD9249_DAQ_custom_1/lvds_dco1_n]
connect_bd_net -net lvds_dco2_p_1_1 [get_bd_ports lvds_dco2_p_1] [get_bd_pins AD9249_DAQ_custom_1/lvds_dco2_p]
connect_bd_net -net lvds_dco2_n_1_1 [get_bd_ports lvds_dco2_n_1] [get_bd_pins AD9249_DAQ_custom_1/lvds_dco2_n]
connect_bd_net -net lvds_fco1_n_1_1 [get_bd_ports lvds_fco1_n_1] [get_bd_pins AD9249_DAQ_custom_1/lvds_fco1_n]
connect_bd_net -net lvds_fco1_p_1_1 [get_bd_ports lvds_fco1_p_1] [get_bd_pins AD9249_DAQ_custom_1/lvds_fco1_p]
connect_bd_net -net lvds_fco2_n_1_1 [get_bd_ports lvds_fco2_n_1] [get_bd_pins AD9249_DAQ_custom_1/lvds_fco2_n]
connect_bd_net -net lvds_fco2_p_1_1 [get_bd_ports lvds_fco2_p_1] [get_bd_pins AD9249_DAQ_custom_1/lvds_fco2_p]
connect_bd_net -net lvds_data_a1_p_1_1 [get_bd_ports lvds_data_a1_p_1] [get_bd_pins AD9249_DAQ_custom_1/lvds_data_a1_p]
connect_bd_net -net lvds_data_a1_n_1_1 [get_bd_ports lvds_data_a1_n_1] [get_bd_pins AD9249_DAQ_custom_1/lvds_data_a1_n]
connect_bd_net -net lvds_data_a2_p_1_1 [get_bd_ports lvds_data_a2_p_1] [get_bd_pins AD9249_DAQ_custom_1/lvds_data_a2_p]
connect_bd_net -net lvds_data_a2_n_1_1 [get_bd_ports lvds_data_a2_n_1] [get_bd_pins AD9249_DAQ_custom_1/lvds_data_a2_n]
connect_bd_net -net lvds_data_b1_n_1_1 [get_bd_ports lvds_data_b1_n_1] [get_bd_pins AD9249_DAQ_custom_1/lvds_data_b1_n]
connect_bd_net -net lvds_data_b1_p_1_1 [get_bd_ports lvds_data_b1_p_1] [get_bd_pins AD9249_DAQ_custom_1/lvds_data_b1_p]
connect_bd_net -net lvds_data_b2_n_1_1 [get_bd_ports lvds_data_b2_n_1] [get_bd_pins AD9249_DAQ_custom_1/lvds_data_b2_n]
connect_bd_net -net lvds_data_b2_p_1_1 [get_bd_ports lvds_data_b2_p_1] [get_bd_pins AD9249_DAQ_custom_1/lvds_data_b2_p]
connect_bd_net -net lvds_data_c1_p_1_1 [get_bd_ports lvds_data_c1_p_1] [get_bd_pins AD9249_DAQ_custom_1/lvds_data_c1_p]
connect_bd_net -net lvds_data_c1_n_1_1 [get_bd_ports lvds_data_c1_n_1] [get_bd_pins AD9249_DAQ_custom_1/lvds_data_c1_n]
connect_bd_net -net lvds_data_c2_n_1_1 [get_bd_ports lvds_data_c2_n_1] [get_bd_pins AD9249_DAQ_custom_1/lvds_data_c2_n]
connect_bd_net -net lvds_data_c2_p_1_1 [get_bd_ports lvds_data_c2_p_1] [get_bd_pins AD9249_DAQ_custom_1/lvds_data_c2_p]
connect_bd_net -net lvds_data_d1_n_1_1 [get_bd_ports lvds_data_d1_n_1] [get_bd_pins AD9249_DAQ_custom_1/lvds_data_d1_n]
connect_bd_net -net lvds_data_d1_p_1_1 [get_bd_ports lvds_data_d1_p_1] [get_bd_pins AD9249_DAQ_custom_1/lvds_data_d1_p]
connect_bd_net -net lvds_data_d2_n_1_1 [get_bd_ports lvds_data_d2_n_1] [get_bd_pins AD9249_DAQ_custom_1/lvds_data_d2_n]
connect_bd_net -net lvds_data_d2_p_1_1 [get_bd_ports lvds_data_d2_p_1] [get_bd_pins AD9249_DAQ_custom_1/lvds_data_d2_p]
connect_bd_net -net lvds_data_e1_n_1_1 [get_bd_ports lvds_data_e1_n_1] [get_bd_pins AD9249_DAQ_custom_1/lvds_data_e1_n]
connect_bd_net -net lvds_data_e1_p_1_1 [get_bd_ports lvds_data_e1_p_1] [get_bd_pins AD9249_DAQ_custom_1/lvds_data_e1_p]
connect_bd_net -net lvds_data_e2_n_1_1 [get_bd_ports lvds_data_e2_n_1] [get_bd_pins AD9249_DAQ_custom_1/lvds_data_e2_n]
connect_bd_net -net lvds_data_e2_p_1_1 [get_bd_ports lvds_data_e2_p_1] [get_bd_pins AD9249_DAQ_custom_1/lvds_data_e2_p]
connect_bd_net -net lvds_data_f1_n_1_1 [get_bd_ports lvds_data_f1_n_1] [get_bd_pins AD9249_DAQ_custom_1/lvds_data_f1_n]
connect_bd_net -net lvds_data_f1_p_1_1 [get_bd_ports lvds_data_f1_p_1] [get_bd_pins AD9249_DAQ_custom_1/lvds_data_f1_p]
connect_bd_net -net lvds_data_f2_n_1_1 [get_bd_ports lvds_data_f2_n_1] [get_bd_pins AD9249_DAQ_custom_1/lvds_data_f2_n]
connect_bd_net -net lvds_data_f2_p_1_1 [get_bd_ports lvds_data_f2_p_1] [get_bd_pins AD9249_DAQ_custom_1/lvds_data_f2_p]
connect_bd_net -net lvds_data_g1_n_1_1 [get_bd_ports lvds_data_g1_n_1] [get_bd_pins AD9249_DAQ_custom_1/lvds_data_g1_n]
connect_bd_net -net lvds_data_g1_p_1_1 [get_bd_ports lvds_data_g1_p_1] [get_bd_pins AD9249_DAQ_custom_1/lvds_data_g1_p]
connect_bd_net -net lvds_data_g2_n_1_1 [get_bd_ports lvds_data_g2_n_1] [get_bd_pins AD9249_DAQ_custom_1/lvds_data_g2_n]
connect_bd_net -net lvds_data_g2_p_1_1 [get_bd_ports lvds_data_g2_p_1] [get_bd_pins AD9249_DAQ_custom_1/lvds_data_g2_p]
connect_bd_net -net lvds_data_h1_n_1_1 [get_bd_ports lvds_data_h1_n_1] [get_bd_pins AD9249_DAQ_custom_1/lvds_data_h1_n]
connect_bd_net -net lvds_data_h1_p_1_1 [get_bd_ports lvds_data_h1_p_1] [get_bd_pins AD9249_DAQ_custom_1/lvds_data_h1_p]
connect_bd_net -net lvds_data_h2_n_1_1 [get_bd_ports lvds_data_h2_n_1] [get_bd_pins AD9249_DAQ_custom_1/lvds_data_h2_n]
connect_bd_net -net lvds_data_h2_p_1_1 [get_bd_ports lvds_data_h2_p_1] [get_bd_pins AD9249_DAQ_custom_1/lvds_data_h2_p]
connect_bd_net -net AD9249_DAQ_custom_1_captured_data_a3 [get_bd_pins AD9249_DAQ_custom_2/captured_data_a1] \
  [get_bd_pins data_select_top_2/in_data_16b_a1]
connect_bd_net -net AD9249_DAQ_custom_1_captured_data_a4 [get_bd_pins AD9249_DAQ_custom_2/captured_data_a2] \
  [get_bd_pins data_select_top_2/in_data_16b_a2]
connect_bd_net -net AD9249_DAQ_custom_1_captured_data_b3 [get_bd_pins AD9249_DAQ_custom_2/captured_data_b1] \
  [get_bd_pins data_select_top_2/in_data_16b_b1]
connect_bd_net -net AD9249_DAQ_custom_1_captured_data_b4 [get_bd_pins AD9249_DAQ_custom_2/captured_data_b2] \
  [get_bd_pins data_select_top_2/in_data_16b_b2]
connect_bd_net -net AD9249_DAQ_custom_1_captured_data_c3 [get_bd_pins AD9249_DAQ_custom_2/captured_data_c1] \
  [get_bd_pins data_select_top_2/in_data_16b_c1]
connect_bd_net -net AD9249_DAQ_custom_1_captured_data_c4 [get_bd_pins AD9249_DAQ_custom_2/captured_data_c2] \
  [get_bd_pins data_select_top_2/in_data_16b_c2]
connect_bd_net -net AD9249_DAQ_custom_1_captured_data_d3 [get_bd_pins AD9249_DAQ_custom_2/captured_data_d1] \
  [get_bd_pins data_select_top_2/in_data_16b_d1]
connect_bd_net -net AD9249_DAQ_custom_1_captured_data_d4 [get_bd_pins AD9249_DAQ_custom_2/captured_data_d2] \
  [get_bd_pins data_select_top_2/in_data_16b_d2]
connect_bd_net -net AD9249_DAQ_custom_1_captured_data_e3 [get_bd_pins AD9249_DAQ_custom_2/captured_data_e1] \
  [get_bd_pins data_select_top_2/in_data_16b_e1]
connect_bd_net -net AD9249_DAQ_custom_1_captured_data_e4 [get_bd_pins AD9249_DAQ_custom_2/captured_data_e2] \
  [get_bd_pins data_select_top_2/in_data_16b_e2]
connect_bd_net -net AD9249_DAQ_custom_1_captured_data_f3 [get_bd_pins AD9249_DAQ_custom_2/captured_data_f1] \
  [get_bd_pins data_select_top_2/in_data_16b_f1]
connect_bd_net -net AD9249_DAQ_custom_1_captured_data_f4 [get_bd_pins AD9249_DAQ_custom_2/captured_data_f2] \
  [get_bd_pins data_select_top_2/in_data_16b_f2]
connect_bd_net -net AD9249_DAQ_custom_1_captured_data_g3 [get_bd_pins AD9249_DAQ_custom_2/captured_data_g1] \
  [get_bd_pins data_select_top_2/in_data_16b_g1]
connect_bd_net -net AD9249_DAQ_custom_1_captured_data_g4 [get_bd_pins AD9249_DAQ_custom_2/captured_data_g2] \
  [get_bd_pins data_select_top_2/in_data_16b_g2]
connect_bd_net -net AD9249_DAQ_custom_1_captured_data_h3 [get_bd_pins AD9249_DAQ_custom_2/captured_data_h1] \
  [get_bd_pins data_select_top_2/in_data_16b_h1]
connect_bd_net -net AD9249_DAQ_custom_1_captured_data_h4 [get_bd_pins AD9249_DAQ_custom_2/captured_data_h2] \
  [get_bd_pins data_select_top_2/in_data_16b_h2]
connect_bd_net -net lvds_data_a1_n_1_2 [get_bd_ports lvds_data_a1_n_2] [get_bd_pins AD9249_DAQ_custom_2/lvds_data_a1_n]
connect_bd_net -net lvds_data_a1_p_1_2 [get_bd_ports lvds_data_a1_p_2] [get_bd_pins AD9249_DAQ_custom_2/lvds_data_a1_p]
connect_bd_net -net lvds_data_a2_n_1_2 [get_bd_ports lvds_data_a2_n_2] [get_bd_pins AD9249_DAQ_custom_2/lvds_data_a2_n]
connect_bd_net -net lvds_data_a2_p_1_2 [get_bd_ports lvds_data_a2_p_2] [get_bd_pins AD9249_DAQ_custom_2/lvds_data_a2_p]
connect_bd_net -net lvds_data_b1_n_1_2 [get_bd_ports lvds_data_b1_n_2] [get_bd_pins AD9249_DAQ_custom_2/lvds_data_b1_n]
connect_bd_net -net lvds_data_b1_p_1_2 [get_bd_ports lvds_data_b1_p_2] [get_bd_pins AD9249_DAQ_custom_2/lvds_data_b1_p]
connect_bd_net -net lvds_data_b2_n_1_2 [get_bd_ports lvds_data_b2_n_2] [get_bd_pins AD9249_DAQ_custom_2/lvds_data_b2_n]
connect_bd_net -net lvds_data_b2_p_1_2 [get_bd_ports lvds_data_b2_p_2] [get_bd_pins AD9249_DAQ_custom_2/lvds_data_b2_p]
connect_bd_net -net lvds_data_c1_n_1_2 [get_bd_ports lvds_data_c1_n_2] [get_bd_pins AD9249_DAQ_custom_2/lvds_data_c1_n]
connect_bd_net -net lvds_data_c1_p_1_2 [get_bd_ports lvds_data_c1_p_2] [get_bd_pins AD9249_DAQ_custom_2/lvds_data_c1_p]
connect_bd_net -net lvds_data_c2_n_1_2 [get_bd_ports lvds_data_c2_n_2] [get_bd_pins AD9249_DAQ_custom_2/lvds_data_c2_n]
connect_bd_net -net lvds_data_c2_p_1_2 [get_bd_ports lvds_data_c2_p_2] [get_bd_pins AD9249_DAQ_custom_2/lvds_data_c2_p]
connect_bd_net -net lvds_data_d1_n_1_2 [get_bd_ports lvds_data_d1_n_2] [get_bd_pins AD9249_DAQ_custom_2/lvds_data_d1_n]
connect_bd_net -net lvds_data_d1_p_1_2 [get_bd_ports lvds_data_d1_p_2] [get_bd_pins AD9249_DAQ_custom_2/lvds_data_d1_p]
connect_bd_net -net lvds_data_d2_n_1_2 [get_bd_ports lvds_data_d2_n_2] [get_bd_pins AD9249_DAQ_custom_2/lvds_data_d2_n]
connect_bd_net -net lvds_data_d2_p_1_2 [get_bd_ports lvds_data_d2_p_2] [get_bd_pins AD9249_DAQ_custom_2/lvds_data_d2_p]
connect_bd_net -net lvds_data_e1_n_1_2 [get_bd_ports lvds_data_e1_n_2] [get_bd_pins AD9249_DAQ_custom_2/lvds_data_e1_n]
connect_bd_net -net lvds_data_e1_p_1_2 [get_bd_ports lvds_data_e1_p_2] [get_bd_pins AD9249_DAQ_custom_2/lvds_data_e1_p]
connect_bd_net -net lvds_data_e2_n_1_2 [get_bd_ports lvds_data_e2_n_2] [get_bd_pins AD9249_DAQ_custom_2/lvds_data_e2_n]
connect_bd_net -net lvds_data_e2_p_1_2 [get_bd_ports lvds_data_e2_p_2] [get_bd_pins AD9249_DAQ_custom_2/lvds_data_e2_p]
connect_bd_net -net lvds_data_f1_n_1_2 [get_bd_ports lvds_data_f1_n_2] [get_bd_pins AD9249_DAQ_custom_2/lvds_data_f1_n]
connect_bd_net -net lvds_data_f1_p_1_2 [get_bd_ports lvds_data_f1_p_2] [get_bd_pins AD9249_DAQ_custom_2/lvds_data_f1_p]
connect_bd_net -net lvds_data_f2_n_1_2 [get_bd_ports lvds_data_f2_n_2] [get_bd_pins AD9249_DAQ_custom_2/lvds_data_f2_n]
connect_bd_net -net lvds_data_f2_p_1_2 [get_bd_ports lvds_data_f2_p_2] [get_bd_pins AD9249_DAQ_custom_2/lvds_data_f2_p]
connect_bd_net -net lvds_data_g1_n_1_2 [get_bd_ports lvds_data_g1_n_2] [get_bd_pins AD9249_DAQ_custom_2/lvds_data_g1_n]
connect_bd_net -net lvds_data_g1_p_1_2 [get_bd_ports lvds_data_g1_p_2] [get_bd_pins AD9249_DAQ_custom_2/lvds_data_g1_p]
connect_bd_net -net lvds_data_g2_n_1_2 [get_bd_ports lvds_data_g2_n_2] [get_bd_pins AD9249_DAQ_custom_2/lvds_data_g2_n]
connect_bd_net -net lvds_data_g2_p_1_2 [get_bd_ports lvds_data_g2_p_2] [get_bd_pins AD9249_DAQ_custom_2/lvds_data_g2_p]
connect_bd_net -net lvds_data_h1_n_1_2 [get_bd_ports lvds_data_h1_n_2] [get_bd_pins AD9249_DAQ_custom_2/lvds_data_h1_n]
connect_bd_net -net lvds_data_h1_p_1_2 [get_bd_ports lvds_data_h1_p_2] [get_bd_pins AD9249_DAQ_custom_2/lvds_data_h1_p]
connect_bd_net -net lvds_data_h2_n_1_2 [get_bd_ports lvds_data_h2_n_2] [get_bd_pins AD9249_DAQ_custom_2/lvds_data_h2_n]
connect_bd_net -net lvds_data_h2_p_1_2 [get_bd_ports lvds_data_h2_p_2] [get_bd_pins AD9249_DAQ_custom_2/lvds_data_h2_p]
connect_bd_net -net lvds_dco1_n_1_2 [get_bd_ports lvds_dco1_n_2] [get_bd_pins AD9249_DAQ_custom_2/lvds_dco1_n]
connect_bd_net -net lvds_dco1_p_1_2 [get_bd_ports lvds_dco1_p_2] [get_bd_pins AD9249_DAQ_custom_2/lvds_dco1_p]
connect_bd_net -net lvds_dco2_n_1_2 [get_bd_ports lvds_dco2_n_2] [get_bd_pins AD9249_DAQ_custom_2/lvds_dco2_n]
connect_bd_net -net lvds_dco2_p_1_2 [get_bd_ports lvds_dco2_p_2] [get_bd_pins AD9249_DAQ_custom_2/lvds_dco2_p]
connect_bd_net -net lvds_fco1_n_1_2 [get_bd_ports lvds_fco1_n_2] [get_bd_pins AD9249_DAQ_custom_2/lvds_fco1_n]
connect_bd_net -net lvds_fco1_p_1_2 [get_bd_ports lvds_fco1_p_2] [get_bd_pins AD9249_DAQ_custom_2/lvds_fco1_p]
connect_bd_net -net lvds_fco2_n_1_2 [get_bd_ports lvds_fco2_n_2] [get_bd_pins AD9249_DAQ_custom_2/lvds_fco2_n]
connect_bd_net -net lvds_fco2_p_1_2 [get_bd_ports lvds_fco2_p_2] [get_bd_pins AD9249_DAQ_custom_2/lvds_fco2_p]
connect_bd_net [get_bd_pins data_select_top_0/out_data_16b_a1] [get_bd_pins PS_Interface_TOP_0/adc_0]
connect_bd_net [get_bd_pins data_select_top_0/out_data_16b_b1] [get_bd_pins PS_Interface_TOP_0/adc_2]
connect_bd_net [get_bd_pins data_select_top_0/out_data_16b_c1] [get_bd_pins PS_Interface_TOP_0/adc_4]
connect_bd_net [get_bd_pins data_select_top_0/out_data_16b_d1] [get_bd_pins PS_Interface_TOP_0/adc_6]
connect_bd_net [get_bd_pins data_select_top_0/out_data_16b_e1] [get_bd_pins PS_Interface_TOP_0/adc_8]
connect_bd_net [get_bd_pins data_select_top_0/out_data_16b_f1] [get_bd_pins PS_Interface_TOP_0/adc_10]
connect_bd_net [get_bd_pins data_select_top_0/out_data_16b_a2] [get_bd_pins PS_Interface_TOP_0/adc_1]
connect_bd_net [get_bd_pins data_select_top_0/out_data_16b_b2] [get_bd_pins PS_Interface_TOP_0/adc_3]
connect_bd_net [get_bd_pins data_select_top_0/out_data_16b_c2] [get_bd_pins PS_Interface_TOP_0/adc_5]
connect_bd_net [get_bd_pins data_select_top_0/out_data_16b_d2] [get_bd_pins PS_Interface_TOP_0/adc_7]
connect_bd_net [get_bd_pins data_select_top_0/out_data_16b_e2] [get_bd_pins PS_Interface_TOP_0/adc_9]
connect_bd_net [get_bd_pins data_select_top_0/out_data_16b_f2] [get_bd_pins PS_Interface_TOP_0/adc_11]
connect_bd_net [get_bd_pins data_select_top_0/out_data_16b_g1] [get_bd_pins PS_Interface_TOP_0/adc_12]
connect_bd_net [get_bd_pins data_select_top_0/out_data_16b_h1] [get_bd_pins PS_Interface_TOP_0/adc_14]
connect_bd_net [get_bd_pins data_select_top_0/out_data_16b_g2] [get_bd_pins PS_Interface_TOP_0/adc_13]
connect_bd_net [get_bd_pins data_select_top_0/out_data_16b_h2] [get_bd_pins PS_Interface_TOP_0/adc_15]
connect_bd_net [get_bd_pins data_select_top_1/out_data_16b_a1] [get_bd_pins PS_Interface_TOP_0/adc_16]
connect_bd_net [get_bd_pins data_select_top_1/out_data_16b_b1] [get_bd_pins PS_Interface_TOP_0/adc_18]
connect_bd_net [get_bd_pins data_select_top_1/out_data_16b_c1] [get_bd_pins PS_Interface_TOP_0/adc_20]
connect_bd_net [get_bd_pins data_select_top_1/out_data_16b_d1] [get_bd_pins PS_Interface_TOP_0/adc_22]
connect_bd_net [get_bd_pins data_select_top_1/out_data_16b_e1] [get_bd_pins PS_Interface_TOP_0/adc_24]
connect_bd_net [get_bd_pins data_select_top_1/out_data_16b_f1] [get_bd_pins PS_Interface_TOP_0/adc_26]
connect_bd_net [get_bd_pins data_select_top_1/out_data_16b_g1] [get_bd_pins PS_Interface_TOP_0/adc_28]
connect_bd_net [get_bd_pins data_select_top_1/out_data_16b_h1] [get_bd_pins PS_Interface_TOP_0/adc_30]
connect_bd_net [get_bd_pins data_select_top_1/out_data_16b_a2] [get_bd_pins PS_Interface_TOP_0/adc_17]
connect_bd_net [get_bd_pins data_select_top_1/out_data_16b_b2] [get_bd_pins PS_Interface_TOP_0/adc_19]
connect_bd_net [get_bd_pins data_select_top_1/out_data_16b_c2] [get_bd_pins PS_Interface_TOP_0/adc_21]
connect_bd_net [get_bd_pins data_select_top_1/out_data_16b_d2] [get_bd_pins PS_Interface_TOP_0/adc_23]
connect_bd_net [get_bd_pins data_select_top_1/out_data_16b_e2] [get_bd_pins PS_Interface_TOP_0/adc_25]
connect_bd_net [get_bd_pins data_select_top_1/out_data_16b_f2] [get_bd_pins PS_Interface_TOP_0/adc_27]
connect_bd_net [get_bd_pins data_select_top_1/out_data_16b_g2] [get_bd_pins PS_Interface_TOP_0/adc_29]
connect_bd_net [get_bd_pins data_select_top_1/out_data_16b_h2] [get_bd_pins PS_Interface_TOP_0/adc_31]
connect_bd_net [get_bd_pins data_select_top_2/out_data_16b_a1] [get_bd_pins PS_Interface_TOP_0/adc_32]
connect_bd_net [get_bd_pins data_select_top_2/out_data_16b_b1] [get_bd_pins PS_Interface_TOP_0/adc_34]
connect_bd_net [get_bd_pins data_select_top_2/out_data_16b_c1] [get_bd_pins PS_Interface_TOP_0/adc_36]
connect_bd_net [get_bd_pins data_select_top_2/out_data_16b_d1] [get_bd_pins PS_Interface_TOP_0/adc_38]
connect_bd_net [get_bd_pins data_select_top_2/out_data_16b_e1] [get_bd_pins PS_Interface_TOP_0/adc_40]
connect_bd_net [get_bd_pins data_select_top_2/out_data_16b_f1] [get_bd_pins PS_Interface_TOP_0/adc_42]
connect_bd_net [get_bd_pins data_select_top_2/out_data_16b_g1] [get_bd_pins PS_Interface_TOP_0/adc_44]
connect_bd_net [get_bd_pins data_select_top_2/out_data_16b_h1] [get_bd_pins PS_Interface_TOP_0/adc_46]
connect_bd_net [get_bd_pins data_select_top_2/out_data_16b_a2] [get_bd_pins PS_Interface_TOP_0/adc_33]
connect_bd_net [get_bd_pins data_select_top_2/out_data_16b_b2] [get_bd_pins PS_Interface_TOP_0/adc_35]
connect_bd_net [get_bd_pins data_select_top_2/out_data_16b_c2] [get_bd_pins PS_Interface_TOP_0/adc_37]
connect_bd_net [get_bd_pins data_select_top_2/out_data_16b_d2] [get_bd_pins PS_Interface_TOP_0/adc_39]
connect_bd_net [get_bd_pins data_select_top_2/out_data_16b_e2] [get_bd_pins PS_Interface_TOP_0/adc_41]
connect_bd_net [get_bd_pins data_select_top_2/out_data_16b_f2] [get_bd_pins PS_Interface_TOP_0/adc_43]
connect_bd_net [get_bd_pins data_select_top_2/out_data_16b_g2] [get_bd_pins PS_Interface_TOP_0/adc_45]
connect_bd_net [get_bd_pins data_select_top_2/out_data_16b_h2] [get_bd_pins PS_Interface_TOP_0/adc_47]
connect_bd_net [get_bd_pins PS_Interface_TOP_0/toMod1] [get_bd_pins modulater_14bit_0/mod_input1]
connect_bd_net [get_bd_pins PS_Interface_TOP_0/toMod2] [get_bd_pins modulater_14bit_0/mod_input2_adress]
connect_bd_net [get_bd_pins clk_wiz_0/clk_out_130] [get_bd_pins modulater_14bit_0/clk_130]
connect_bd_net [get_bd_pins modulater_14bit_0/mod_out] [get_bd_ports modulator_out]
connect_bd_net [get_bd_pins modulater_14bit_0/carrier_zero] [get_bd_pins processing_system7_0/Core0_nFIQ]
connect_bd_net [get_bd_pins PS_Interface_TOP_0/PS_IN] [get_bd_pins processing_system7_0/GPIO_I]
connect_bd_net [get_bd_pins processing_system7_0/GPIO_O] [get_bd_pins PS_Interface_TOP_0/PS_OUT]
connect_bd_net [get_bd_pins AD9249_DAQ_custom_1/sysclk_ready] [get_bd_ports sysclk_ready_1]
connect_bd_net [get_bd_pins AD9249_DAQ_custom_2/sysclk_ready] [get_bd_ports sysclk_ready_2]

# ---- address map ----
assign_bd_address -offset 0x41280000 -range 64K -target_address_space [get_bd_addr_spaces processing_system7_0/Data] [get_bd_addr_segs axi_gpio_8/S_AXI/Reg]
assign_bd_address -offset 0x41290000 -range 64K -target_address_space [get_bd_addr_spaces processing_system7_0/Data] [get_bd_addr_segs axi_gpio_9/S_AXI/Reg]
assign_bd_address -offset 0x412A0000 -range 64K -target_address_space [get_bd_addr_spaces processing_system7_0/Data] [get_bd_addr_segs axi_gpio_10/S_AXI/Reg]
assign_bd_address -offset 0x412B0000 -range 64K -target_address_space [get_bd_addr_spaces processing_system7_0/Data] [get_bd_addr_segs axi_gpio_11/S_AXI/Reg]
assign_bd_address -offset 0x412C0000 -range 64K -target_address_space [get_bd_addr_spaces processing_system7_0/Data] [get_bd_addr_segs axi_gpio_12/S_AXI/Reg]

validate_bd_design
save_bd_design
